# Altium schematic sheet PATHOS_FPGA_Clk.SchDoc: FPGA Clock
size A4; Author: A. Kalberer; CompanyName: NTB; Organization: NTB Interstate University of Applied; Address1: Werdenbergstrasse 4; Address3: 9471 Buchs; Address4: Switzerland; Organization1: Sciences of Technology Buchs; Size: A4
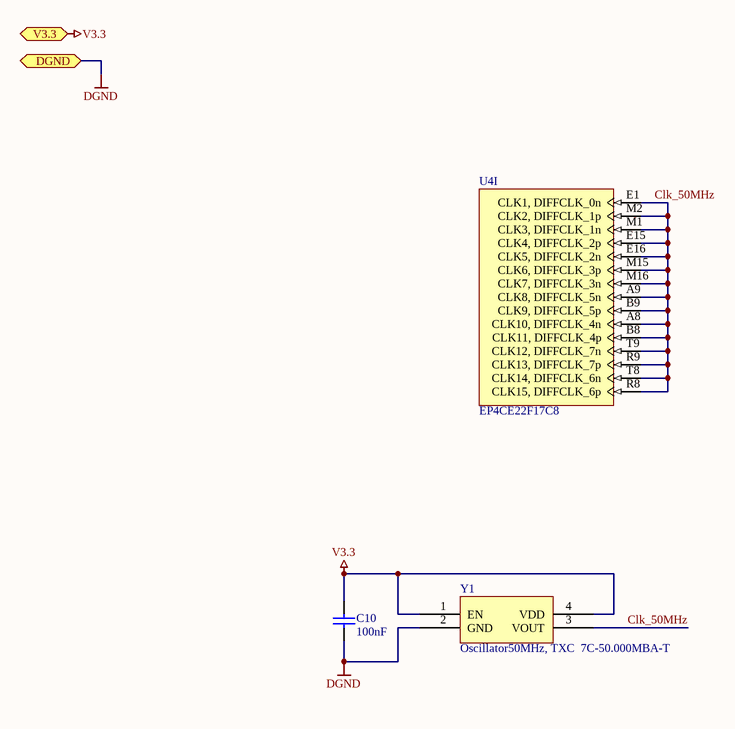
[diagram p0: PATHOS_FPGA_Clk.SchDoc]

## Parts
C10  100nF  [0603_3D]
U4  EP4CE22F17C8  [FBGA256]  (part I of 13)
Y1  Oscillator50MHz, TXC  7C-50.000MBA-T  [OSC_50MHz_TXC]

## Ports
DGND (bidir), V3.3 (in)

## Nets
DGND: C10.1 Y1.2(GND) ; port DGND
V3.3: C10.2 Y1.1(EN) Y1.4(VDD) ; port V3.3
Clk_50MHz: U4.A8(CLK10,_DIFFCLK_4n) U4.A9(CLK8,_DIFFCLK_5n) U4.B8(CLK11,_DIFFCLK_4p) U4.B9(CLK9,_DIFFCLK_5p) U4.E1(CLK1,_DIFFCLK_0n) U4.E15(CLK4,_DIFFCLK_2p) U4.E16(CLK5,_DIFFCLK_2n) U4.M1(CLK3,_DIFFCLK_1n) U4.M2(CLK2,_DIFFCLK_1p) U4.M15(CLK6,_DIFFCLK_3p) U4.M16(CLK7,_DIFFCLK_3n) U4.R8(CLK15,_DIFFCLK_6p) U4.R9(CLK13,_DIFFCLK_7p) U4.T8(CLK14,_DIFFCLK_6n) U4.T9(CLK12,_DIFFCLK_7n) Y1.3(VOUT)

## Notes on the sheet
- Title:
- Description:
- Size:
- Date:
- Name:
- Number:
- Time:
- Revision:
- Sheet
- Checked:
- of
- File:

## Library data of the parts
C10 = C: Capacitor; #Manufacturer: Generic Components; #Publisher: Dr. A. Heinzelmann; #Class: Passive; Initial Voltage: 0V; #Published: 2006-10-07; #ClassSub: Capacitor; Type: *; Voltage Maximum: *; Value: 100nF
U4 = EP4CE22F17C8: Cyclone IV Family FPGA, 2V Core, 153 I/O Pins, 4 PLLs, 256-Pin FBGA, Speed Grade 8, Commercial Grade; Published: 3-May-2010; DatasheetVersion: ver1.2, Mar-2010; PackageVersion: ver16.0, Dec-2009; PackageReference: FBGA256; Publisher: Altium Limited; PackageDescription: 256-Ball FineLine Ball Grid Array (FBGA256) - Option 1 - Wire Bond; Supplier 1: Digi-Key; Supplier Part Number 1: EP4CE22F17C8-ND; Code_JEDEC: MS-034-AAF-1; Code_IPC: BGA100P16X16-256; ComponentLink1Description: Manufacturer Link; ComponentLink1URL: http://www.altera.com/; ComponentLink2Description: Handbook; ComponentLink2URL: http://www.altera.com/literature/hb/cyclone-iv/cyclone4-handbook.pdf; ComponentLink3Description: Pinout Specification; ComponentLink3URL: http://www.altera.com/literature/lit-dp.jsp?category=cyc%204&showspreadsheet=y; ComponentLink4Description: Packaging Specification; ComponentLink4URL: http://www.altera.com/literature/ds/dspkg.pdf
Y1 = Oscillator50MHz